# EAGLE schematic Actuator (EAGLE 9.5.1)

## Sheet 1 of 3: Connectors
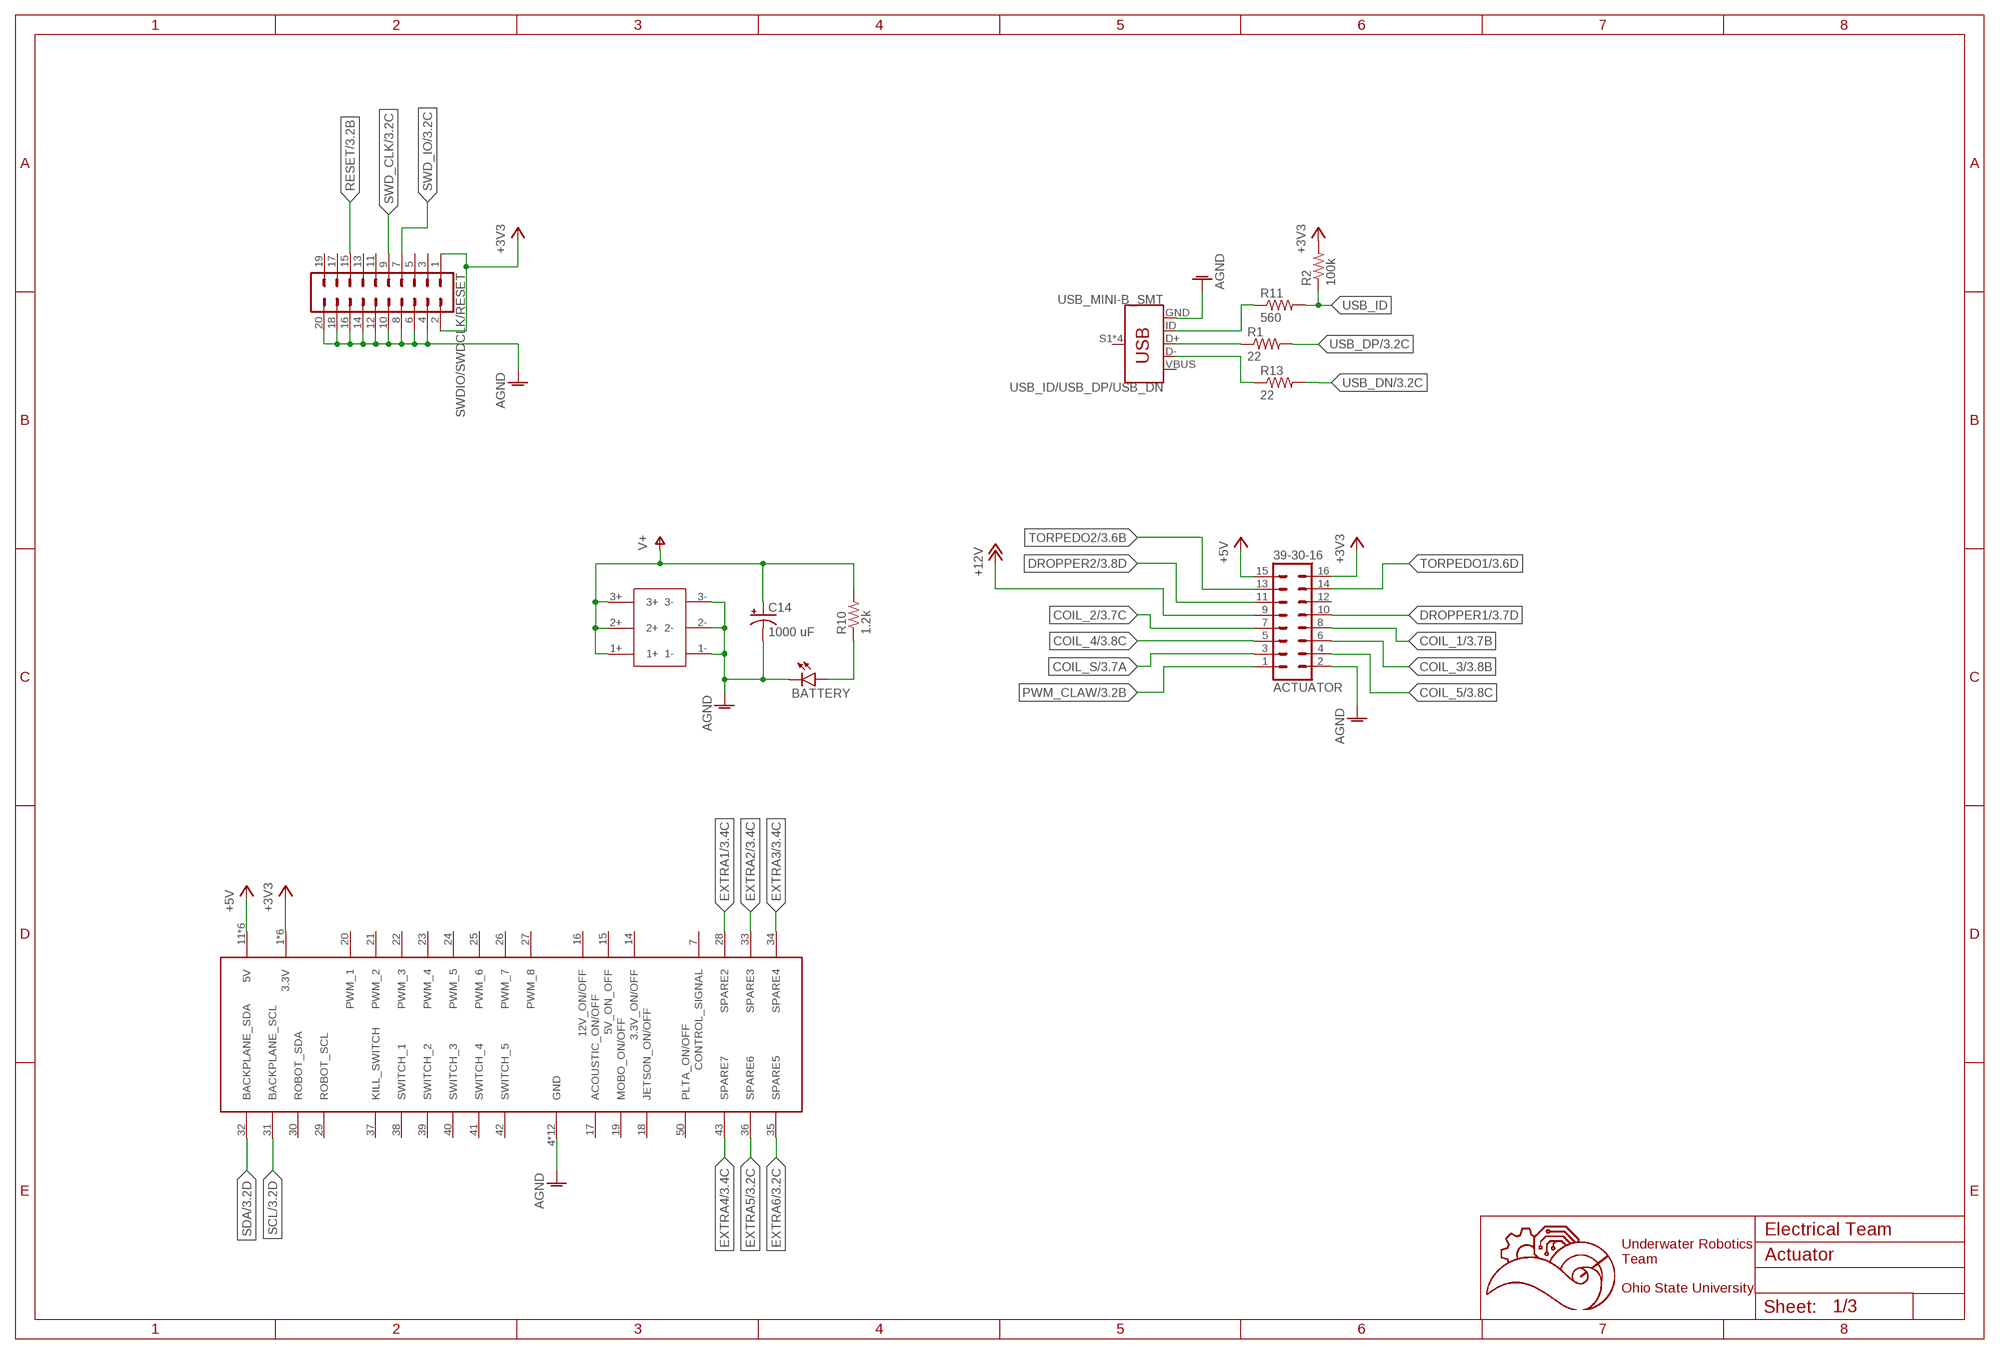
[diagram p0: schematic, sheet 1]

### Parts
ACTUATOR  39-30-16  [39-30-?16?]
BATTERY  LEDCHIPLED_0603  [CHIPLED_0603]
C14  1000 uF  CPOL-USE5-13  [E5-13]
R1  22  R-US_R0603  [R0603]
R2  100k  R-US_R0603  [R0603]
R10  1.2k  R-US_R0805  [R0805]
R11  560  R-US_R0603  [R0603]
R13  22  R-US_R0603  [R0603]
SWDIO/SWDCLK/RESET  CONN_10X2  [2X10]
U$1  5530843-EDGE  [5530843-6-BOARDFINGERS]
U$3  6PIN-VERT  [6PIN_VERT]
USB_ID/USB_DP/USB_DN  USB_MINI-B_SMT  [USB-MINIB]

### Nets
+3V3: ACTUATOR.16 R2.2 SWDIO/SWDCLK/RESET.1 SWDIO/SWDCLK/RESET.2 U$1.1(3.3V) U$1.2(3.3V) U$1.3(3.3V) U$1.54(3.3V) U$1.55(3.3V) U$1.56(3.3V) ; also sheet 2,3
+5V: ACTUATOR.15 U$1.11(5V) U$1.12(5V) U$1.13(5V) U$1.44(5V) U$1.45(5V) U$1.46(5V)
+12V: ACTUATOR.9 ; also sheet 3
AGND: ACTUATOR.2 BATTERY.C C14.- SWDIO/SWDCLK/RESET.4 SWDIO/SWDCLK/RESET.6 SWDIO/SWDCLK/RESET.8 SWDIO/SWDCLK/RESET.10 SWDIO/SWDCLK/RESET.12 SWDIO/SWDCLK/RESET.14 SWDIO/SWDCLK/RESET.16 SWDIO/SWDCLK/RESET.18 SWDIO/SWDCLK/RESET.20 U$1.4(GND) U$1.5(GND) U$1.6(GND) U$1.8(GND) U$1.9(GND) U$1.10(GND) U$1.47(GND) U$1.48(GND) U$1.49(GND) U$1.51(GND) U$1.52(GND) U$1.53(GND) U$3.1- U$3.2- U$3.3- USB_ID/USB_DP/USB_DN.GND ; also sheet 2,3
COIL_1: ACTUATOR.8 ; also sheet 3
COIL_2: ACTUATOR.7 ; also sheet 3
COIL_3: ACTUATOR.6 ; also sheet 3
COIL_4: ACTUATOR.5 ; also sheet 3
COIL_5: ACTUATOR.4 ; also sheet 3
COIL_S: ACTUATOR.3 ; also sheet 3
DROPPER1: ACTUATOR.10 ; also sheet 3
DROPPER2: ACTUATOR.11 ; also sheet 3
EXTRA1: U$1.28(SPARE2) ; also sheet 3
EXTRA2: U$1.33(SPARE3) ; also sheet 3
EXTRA3: U$1.34(SPARE4) ; also sheet 3
EXTRA4: U$1.43(SPARE7) ; also sheet 3
EXTRA5: U$1.36(SPARE6) ; also sheet 3
EXTRA6: U$1.35(SPARE5) ; also sheet 3
N$6: R11.1 USB_ID/USB_DP/USB_DN.ID
N$7: R1.1 USB_ID/USB_DP/USB_DN.D+
N$8: R13.1 USB_ID/USB_DP/USB_DN.D-
N$9: BATTERY.A R10.1
PWM_CLAW: ACTUATOR.1 ; also sheet 3
RESET: SWDIO/SWDCLK/RESET.15 ; also sheet 3
SCL: U$1.31(BACKPLANE_SCL) ; also sheet 3
SDA: U$1.32(BACKPLANE_SDA) ; also sheet 3
SWD_CLK: SWDIO/SWDCLK/RESET.9 ; also sheet 3
SWD_IO: SWDIO/SWDCLK/RESET.7 ; also sheet 3
TORPEDO1: ACTUATOR.14 ; also sheet 3
TORPEDO2: ACTUATOR.13 ; also sheet 3
USB_DN: R13.2 ; also sheet 3
USB_DP: R1.2 ; also sheet 3
USB_ID: R2.1 R11.2
V+: C14.+ R10.2 U$3.1+ U$3.2+ U$3.3+ ; also sheet 2
Unconnected: ACTUATOR.12 SWDIO/SWDCLK/RESET.3 SWDIO/SWDCLK/RESET.5 SWDIO/SWDCLK/RESET.11 SWDIO/SWDCLK/RESET.13 SWDIO/SWDCLK/RESET.17 SWDIO/SWDCLK/RESET.19 U$1.7(CONTROL_SIGNAL) U$1.14(3.3V_ON/OFF) U$1.15(5V_ON_OFF) U$1.16(12V_ON/OFF) U$1.17(ACOUSTIC_ON/OFF) U$1.18(JETSON_ON/OFF) U$1.19(MOBO_ON/OFF) U$1.20(PWM_1) U$1.21(PWM_2) U$1.22(PWM_3) U$1.23(PWM_4) U$1.24(PWM_5) U$1.25(PWM_6) U$1.26(PWM_7) U$1.27(PWM_8) U$1.29(ROBOT_SCL) U$1.30(ROBOT_SDA) U$1.37(KILL_SWITCH) U$1.38(SWITCH_1) U$1.39(SWITCH_2) U$1.40(SWITCH_3) U$1.41(SWITCH_4) U$1.42(SWITCH_5) U$1.50(PLTA_ON/OFF) USB_ID/USB_DP/USB_DN.S1(SHIELD) USB_ID/USB_DP/USB_DN.S2(SHIELD) USB_ID/USB_DP/USB_DN.S3(SHIELD) USB_ID/USB_DP/USB_DN.S4(SHIELD)

### Notes on the sheet
- Electrical Team
- Underwater Robotics
  Team
  
  Ohio State University

## Sheet 2 of 3
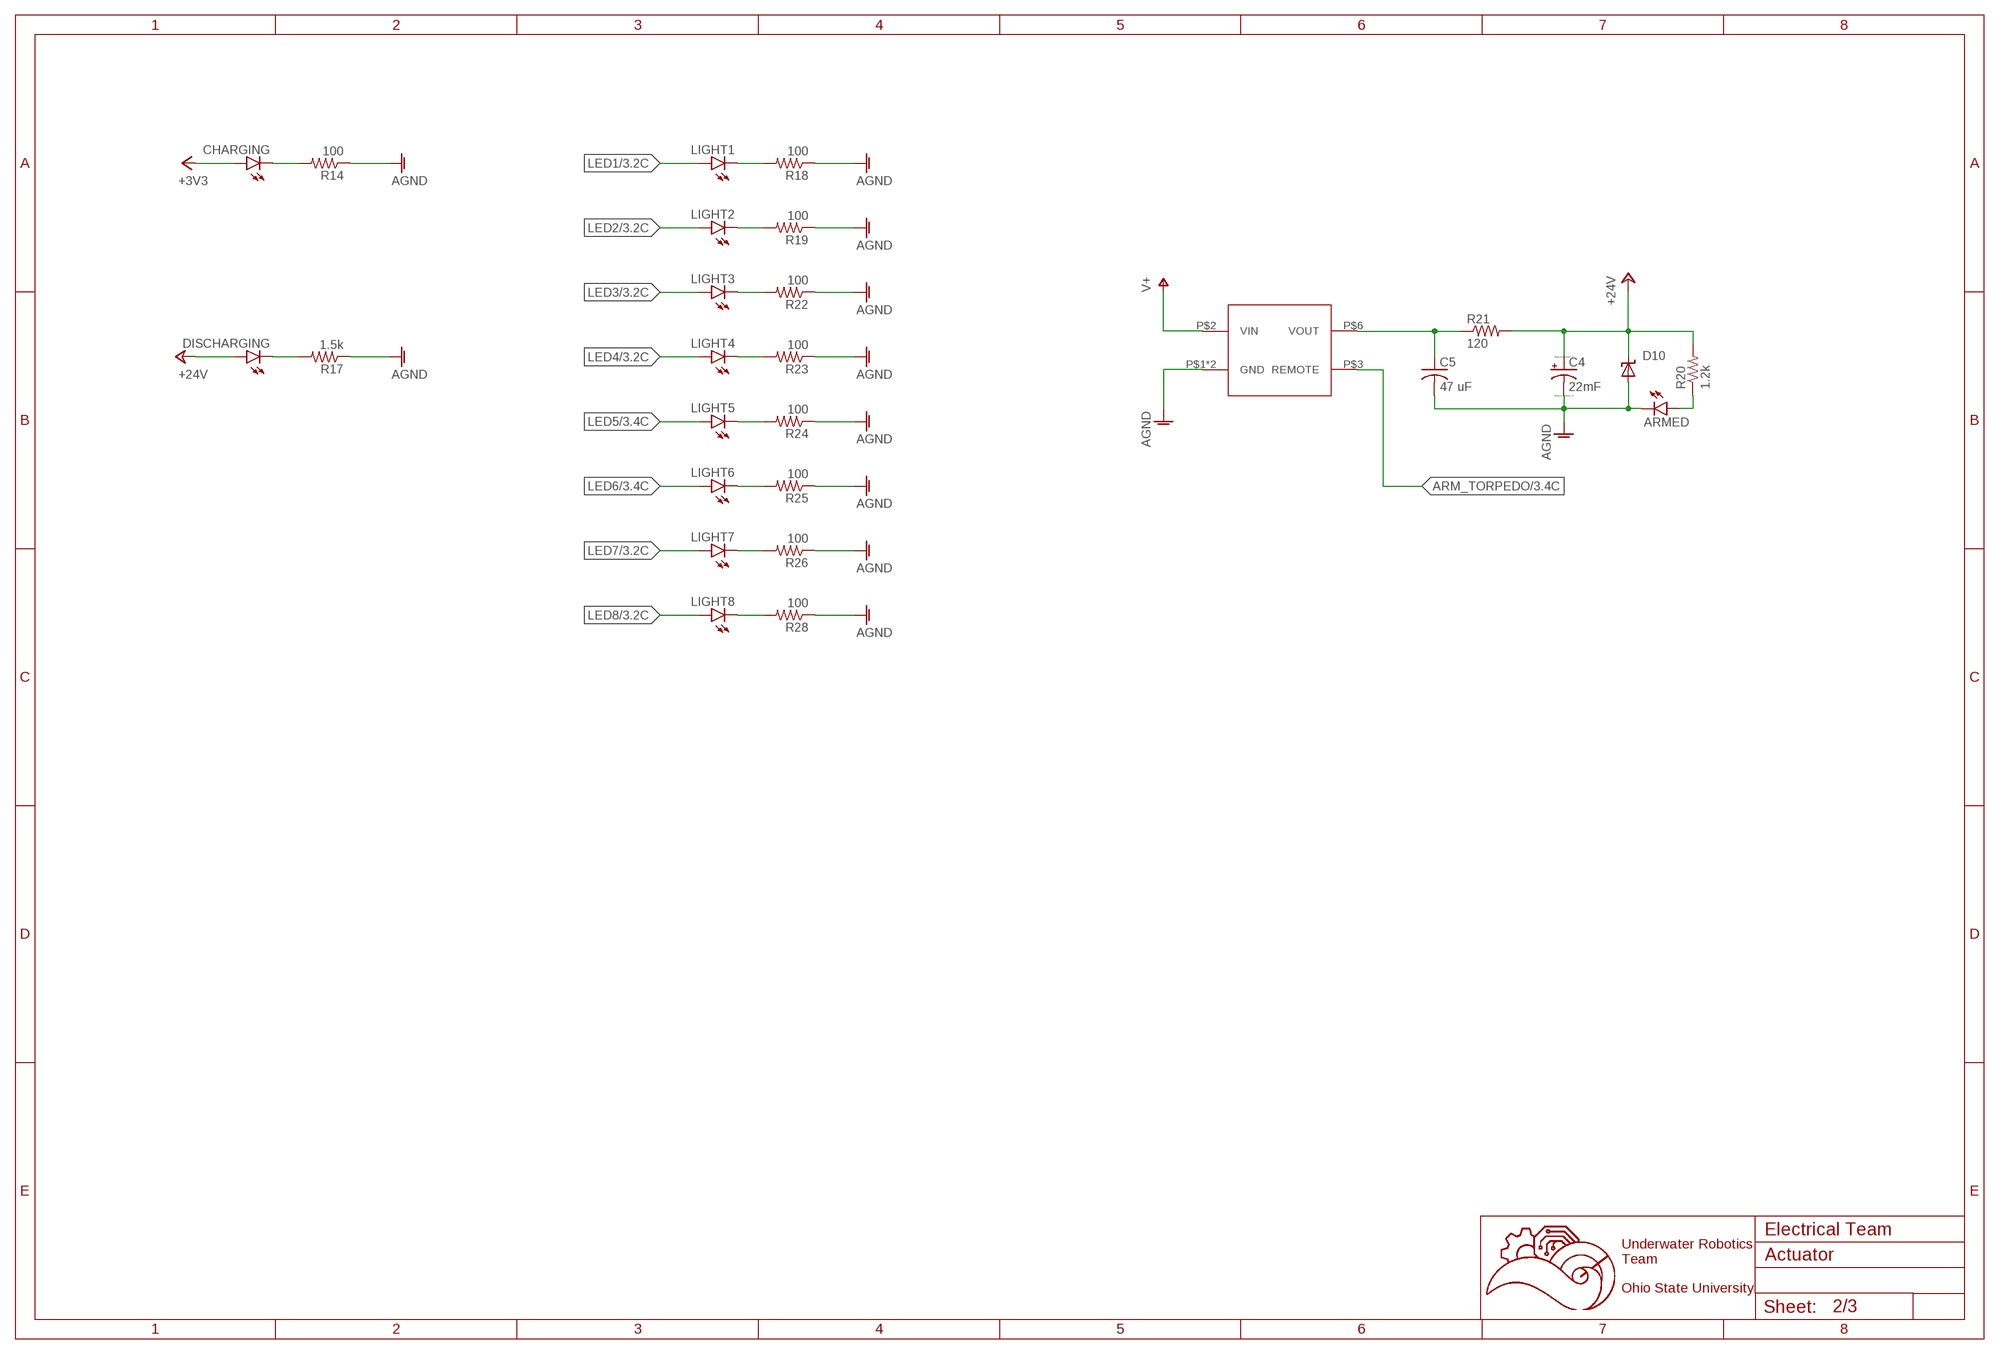
[diagram p1: schematic, sheet 2]

### Parts
ARMED  LEDCHIPLED_0603  [CHIPLED_0603]
C4  22mF  CPOL-USE10-30  [EB30D]
C5  47 uF  C-USC1206K  [C1206K]
CHARGING  LEDCHIPLED_0603  [CHIPLED_0603]
D10  SUPPRESSOR-SMBJ  [SMBJ]
DISCHARGING  LEDCHIPLED_0603  [CHIPLED_0603]
LIGHT1  LEDCHIPLED_0603  [CHIPLED_0603]
LIGHT2  LEDCHIPLED_0603  [CHIPLED_0603]
LIGHT3  LEDCHIPLED_0603  [CHIPLED_0603]
LIGHT4  LEDCHIPLED_0603  [CHIPLED_0603]
LIGHT5  LEDCHIPLED_0603  [CHIPLED_0603]
LIGHT6  LEDCHIPLED_0603  [CHIPLED_0603]
LIGHT7  LEDCHIPLED_0603  [CHIPLED_0603]
LIGHT8  LEDCHIPLED_0603  [CHIPLED_0603]
R14  100  R-US_R0805  [R0805]
R17  1.5k  R-US_R0805  [R0805]
R18  100  R-US_R0805  [R0805]
R19  100  R-US_R0805  [R0805]
R20  1.2k  R-US_R0805  [R0805]
R21  120  R-US_R6332W  [R6332W]
R22  100  R-US_R0805  [R0805]
R23  100  R-US_R0805  [R0805]
R24  100  R-US_R0805  [R0805]
R25  100  R-US_R0805  [R0805]
R26  100  R-US_R0805  [R0805]
R28  100  R-US_R0805  [R0805]
U$6  TMR6-2415  [TMR6-2415]

### Nets
+3V3: CHARGING.A ; also sheet 1,3
+24V: C4.+ D10.C DISCHARGING.A R20.2 R21.2 ; also sheet 3
AGND: ARMED.C C4.- C5.2 D10.A R14.1 R17.1 R18.1 R19.1 R22.1 R23.1 R24.1 R25.1 R26.1 R28.1 U$6.P$1(GND) U$6.P$7(GND) ; also sheet 1,3
ARM_TORPEDO: U$6.P$3(REMOTE) ; also sheet 3
LED1: LIGHT1.A ; also sheet 3
LED2: LIGHT2.A ; also sheet 3
LED3: LIGHT3.A ; also sheet 3
LED4: LIGHT4.A ; also sheet 3
LED5: LIGHT5.A ; also sheet 3
LED6: LIGHT6.A ; also sheet 3
LED7: LIGHT7.A ; also sheet 3
LED8: LIGHT8.A ; also sheet 3
N$4: CHARGING.C R14.2
N$10: ARMED.A R20.1
N$15: DISCHARGING.C R17.2
N$16: LIGHT1.C R18.2
N$17: LIGHT2.C R19.2
N$18: LIGHT3.C R22.2
N$19: LIGHT4.C R23.2
N$21: LIGHT5.C R24.2
N$22: LIGHT6.C R25.2
N$23: LIGHT7.C R26.2
N$24: LIGHT8.C R28.2
N$26: C5.1 R21.1 U$6.P$6(VOUT)
V+: U$6.P$2(VIN) ; also sheet 1

### Notes on the sheet
- Electrical Team
- Underwater Robotics
  Team
  
  Ohio State University

## Sheet 3 of 3
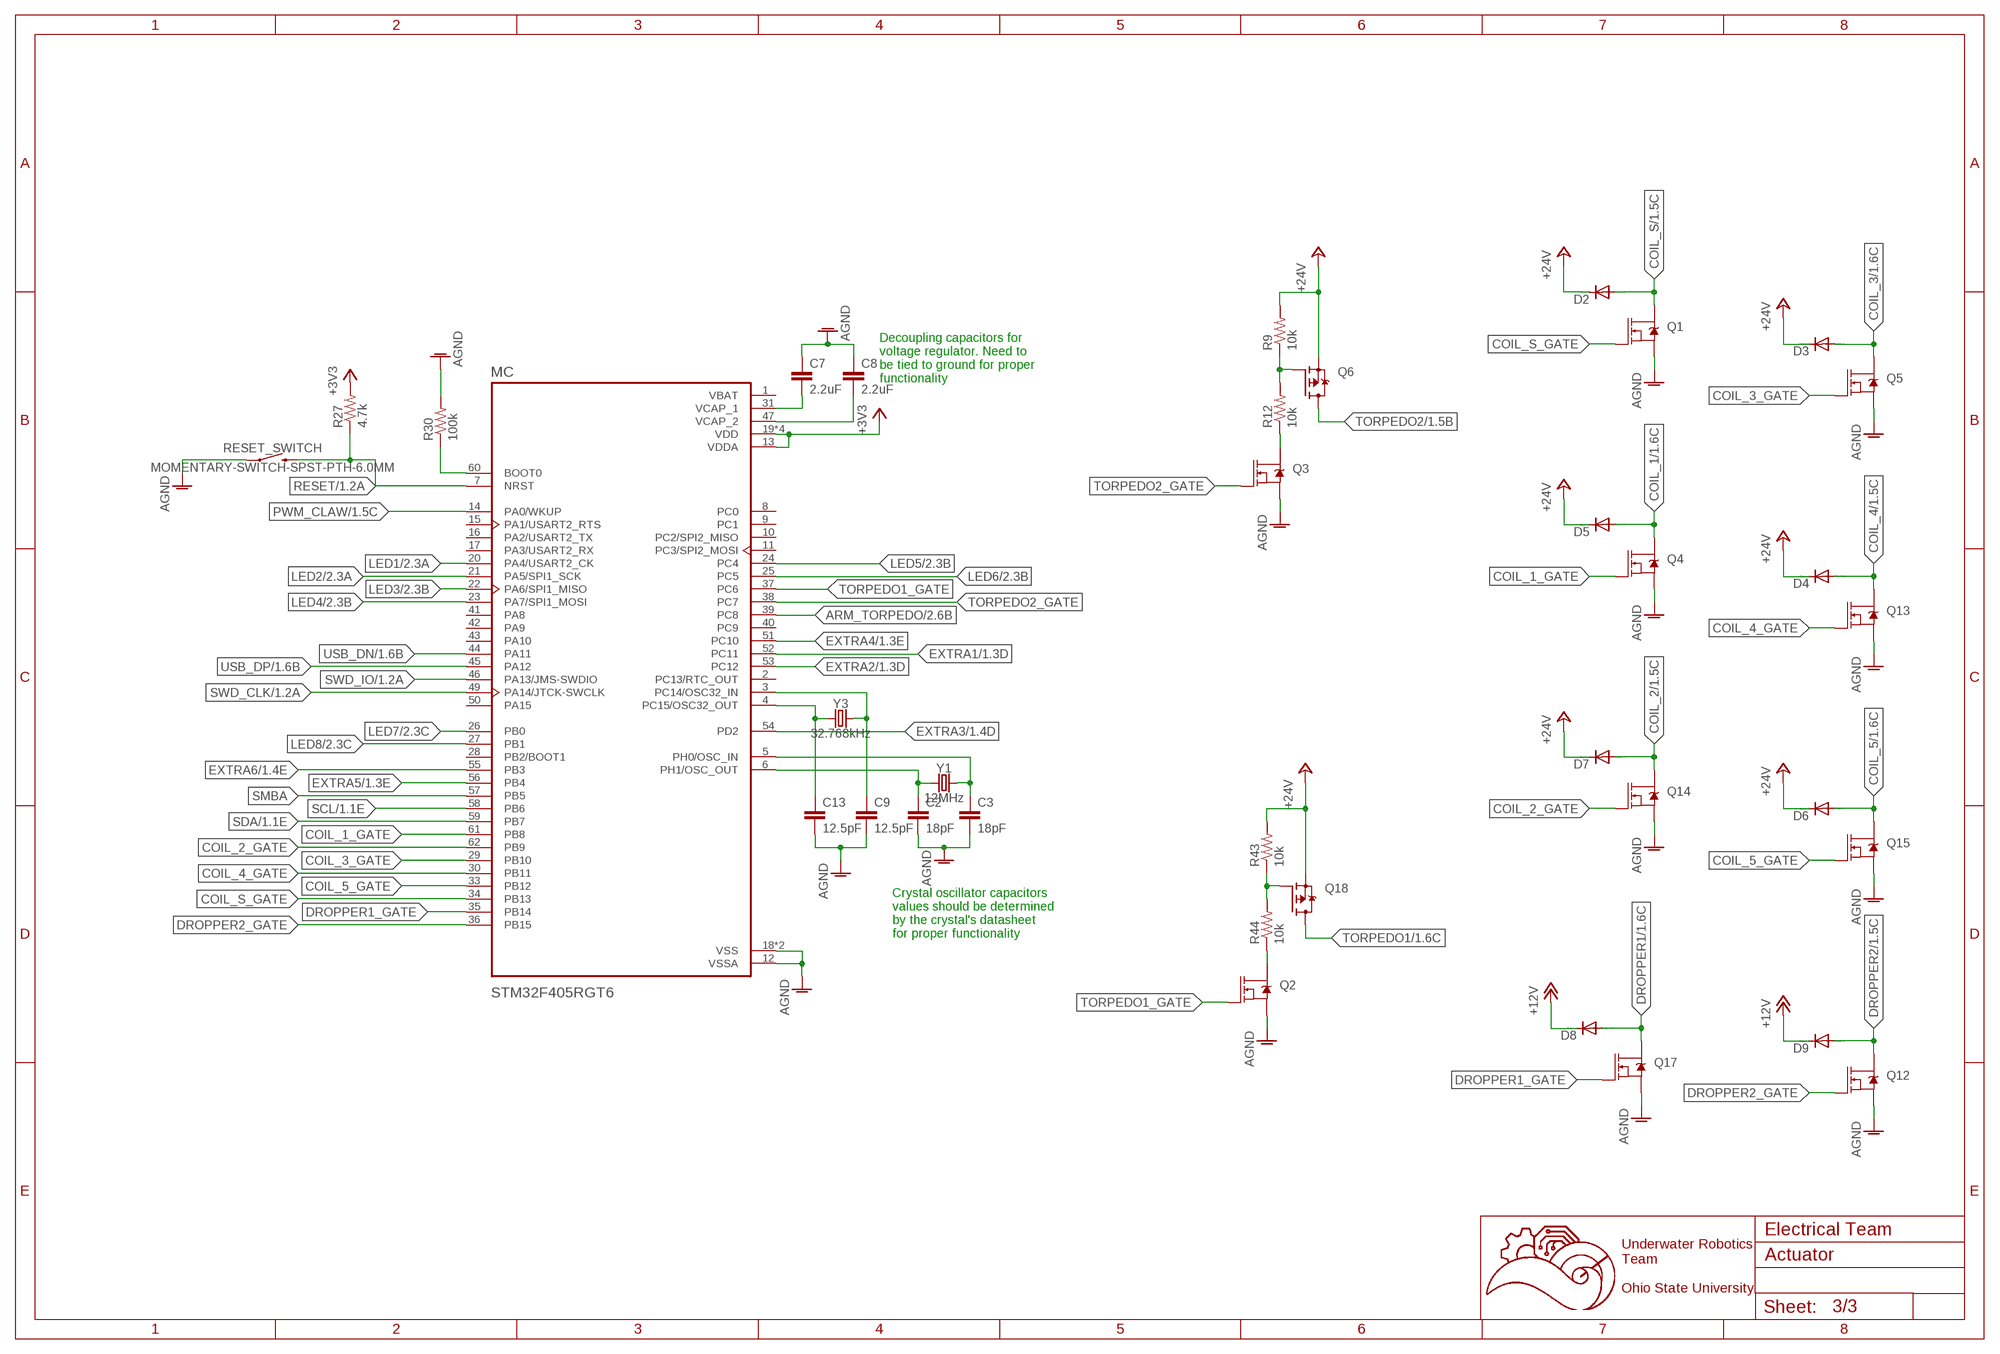
[diagram p2: schematic, sheet 3]

### Parts
C2  18pF  C-EUC0603  [C0603]
C3  18pF  C-EUC0603  [C0603]
C7  2.2uF  C-EUC0603  [C0603]
C8  2.2uF  C-EUC0603  [C0603]
C9  12.5pF  C-EUC0603  [C0603]
C13  12.5pF  C-EUC0603  [C0603]
D2  DIODE-SMB  [SMB]
D3  DIODE-SMB  [SMB]
D4  DIODE-SMB  [SMB]
D5  DIODE-SMB  [SMB]
D6  DIODE-SMB  [SMB]
D7  DIODE-SMB  [SMB]
D8  DIODE-SMB  [SMB]
D9  DIODE-SMB  [SMB]
MC  STM32F405RGT6  [QFP50P1200X1200X160-64N]
Q1  MOSFET-NCH-AO3404A  [SOT23-3]
Q2  MOSFET-NCH-AO3404A  [SOT23-3]
Q3  MOSFET-NCH-AO3404A  [SOT23-3]
Q4  MOSFET-NCH-AO3404A  [SOT23-3]
Q5  MOSFET-NCH-AO3404A  [SOT23-3]
Q6  FDD4141TO252  [TO252]
Q12  MOSFET-NCH-AO3404A  [SOT23-3]
Q13  MOSFET-NCH-AO3404A  [SOT23-3]
Q14  MOSFET-NCH-AO3404A  [SOT23-3]
Q15  MOSFET-NCH-AO3404A  [SOT23-3]
Q17  MOSFET-NCH-AO3404A  [SOT23-3]
Q18  FDD4141TO252  [TO252]
R9  10k  R-US_R0603  [R0603]
R12  10k  R-US_R0603  [R0603]
R27  4.7k  R-US_R0603  [R0603]
R30  100k  R-US_R0603  [R0603]
R43  10k  R-US_R0603  [R0603]
R44  10k  R-US_R0603  [R0603]
RESET_SWITCH  MOMENTARY-SWITCH-SPST-PTH-6.0MM  [TACTILE_SWITCH_PTH_6.0MM]
Y1  12MHz  CRYSTAL-16MHZPTH-HC49US  [HC49US]
Y3  32.768kHz  CRYSTAL-32.768KHZSMD-3.2X1.5  [CRYSTAL-SMD-3.2X1.5MM]

### Nets
+3V3: MC.13(VDDA) MC.19(VDD) MC.32(VDD) MC.48(VDD) MC.64(VDD) R27.2 ; also sheet 1,2
+12V: D8.C D9.C ; also sheet 1
+24V: D2.C D3.C D4.C D5.C D6.C D7.C Q6.2(S) Q18.2(S) R9.2 R43.2 ; also sheet 2
AGND: C2.2 C3.2 C7.1 C8.1 C9.2 C13.2 MC.12(VSSA) MC.18(VSS) MC.63(VSS) Q1.2(S) Q2.2(S) Q3.2(S) Q4.2(S) Q5.2(S) Q12.2(S) Q13.2(S) Q14.2(S) Q15.2(S) Q17.2(S) R30.2 RESET_SWITCH.1 ; also sheet 1,2
ARM_TORPEDO: MC.39(PC8) ; also sheet 2
COIL_1: D5.A Q4.3(D) ; also sheet 1
COIL_1_GATE: MC.61(PB8) Q4.1(G)
COIL_2: D7.A Q14.3(D) ; also sheet 1
COIL_2_GATE: MC.62(PB9) Q14.1(G)
COIL_3: D3.A Q5.3(D) ; also sheet 1
COIL_3_GATE: MC.29(PB10) Q5.1(G)
COIL_4: D4.A Q13.3(D) ; also sheet 1
COIL_4_GATE: MC.30(PB11) Q13.1(G)
COIL_5: D6.A Q15.3(D) ; also sheet 1
COIL_5_GATE: MC.33(PB12) Q15.1(G)
COIL_S: D2.A Q1.3(D) ; also sheet 1
COIL_S_GATE: MC.34(PB13) Q1.1(G)
DROPPER1: D8.A Q17.3(D) ; also sheet 1
DROPPER1_GATE: MC.35(PB14) Q17.1(G)
DROPPER2: D9.A Q12.3(D) ; also sheet 1
DROPPER2_GATE: MC.36(PB15) Q12.1(G)
EXTRA1: MC.52(PC11) ; also sheet 1
EXTRA2: MC.53(PC12) ; also sheet 1
EXTRA3: MC.54(PD2) ; also sheet 1
EXTRA4: MC.51(PC10) ; also sheet 1
EXTRA5: MC.56(PB4) ; also sheet 1
EXTRA6: MC.55(PB3) ; also sheet 1
LED1: MC.20(PA4/USART2_CK) ; also sheet 2
LED2: MC.21(PA5/SPI1_SCK) ; also sheet 2
LED3: MC.22(PA6/SPI1_MISO) ; also sheet 2
LED4: MC.23(PA7/SPI1_MOSI) ; also sheet 2
LED5: MC.24(PC4) ; also sheet 2
LED6: MC.25(PC5) ; also sheet 2
LED7: MC.26(PB0) ; also sheet 2
LED8: MC.27(PB1) ; also sheet 2
N$1: C2.1 MC.6(PH1/OSC_OUT) Y1.1
N$2: C3.1 MC.5(PH0/OSC_IN) Y1.2
N$3: C8.2 MC.47(VCAP_2)
N$5: C13.1 MC.4(PC15/OSC32_OUT) Y3.P$1
N$11: C7.2 MC.31(VCAP_1)
N$14: Q2.3(D) R44.1
N$20: Q18.1(G) R43.1 R44.2
N$25: Q6.1(G) R9.1 R12.2
N$28: Q3.3(D) R12.1
N$29: C9.1 MC.3(PC14/OSC32_IN) Y3.P$2
N$30: MC.60(BOOT0) R30.1
PWM_CLAW: MC.14(PA0/WKUP) ; also sheet 1
RESET: MC.7(NRST) R27.1 RESET_SWITCH.3 ; also sheet 1
SCL: MC.58(PB6) ; also sheet 1
SDA: MC.59(PB7) ; also sheet 1
SMBA: MC.57(PB5)
SWD_CLK: MC.49(PA14/JTCK-SWCLK) ; also sheet 1
SWD_IO: MC.46(PA13/JMS-SWDIO) ; also sheet 1
TORPEDO1: Q18.3(D) ; also sheet 1
TORPEDO1_GATE: MC.37(PC6) Q2.1(G)
TORPEDO2: Q6.3(D) ; also sheet 1
TORPEDO2_GATE: MC.38(PC7) Q3.1(G)
USB_DN: MC.44(PA11) ; also sheet 1
USB_DP: MC.45(PA12) ; also sheet 1
Unconnected: MC.2(PC13/RTC_OUT) MC.8(PC0) MC.9(PC1) MC.10(PC2/SPI2_MISO) MC.11(PC3/SPI2_MOSI) MC.15(PA1/USART2_RTS) MC.16(PA2/USART2_TX) MC.17(PA3/USART2_RX) MC.28(PB2/BOOT1) MC.40(PC9) MC.41(PA8) MC.42(PA9) MC.43(PA10) MC.50(PA15)

### Notes on the sheet
- Decoupling capacitors for 
  voltage regulator. Need to
  be tied to ground for proper
  functionality
- Crystal oscillator capacitors
  values should be determined
  by the crystal's datasheet
  for proper functionality
- Electrical Team
- Underwater Robotics
  Team
  
  Ohio State University

## Power pins joined to a net without a drawn wire
VBAT: MC.1(VBAT)
VBUS: USB_ID/USB_DP/USB_DN.VBUS

## Library data of the parts
ACTUATOR = con-molex-mini-fit:39-30-?16?: HEADER
ARMED BATTERY CHARGING DISCHARGING LIGHT1-LIGHT8 = led:LED: LED OSRAM: - CHIPLED LG R971, LG N971, LY N971, LG Q971, LY Q971, LO R971, LY R971 LH N974, LH R974 LS Q976, LO Q976, LY Q976 LO Q996 - Hyper CHIPLED LW Q18S LB Q993, LB Q99A, LB R99A - SideLED LS A670, LO A670, LY A670, LG A670, LP A670 LB A673, LV A673, LT A673, LW A673 LH A674 LY A675 LS A676, LA A676, LO A676, LY A676, LW A676 LS A679, LY A679, LG A679 - Hyper Micro SIDELED® LS Y876, LA Y876, LO Y876, LY Y876 LT Y87S - SmartLED LW L88C, LW L88S LB L89C, LB L89S, LG L890 LS L89K, LO L89K, LY L89K LS L896, LA L896, LO L896, LY L896 - TOPLED LS T670, LO T670, LY T670, LG T670, LP T670 LSG T670, LSP T670, LSY T670, LOP T670, LYG T670 LG T671, LOG T671, LSG T671 LB T673, LV T673, LT T673, LW T673 LH T674 LS T676, LA T676, LO T676, LY T676, LB T676, LH T676, LSB T676, LW T676 LB T67C, LV T67C, LT T67C, LS T67K, LO T67K, LY T67K, LW E67C LS E67B, LA E67B, LO E67B, LY E67B, LB E67C, LV E67C, LT E67C LW T67C LS T679, LY T679, LG T679 LS T770, LO T770, LY T770, LG T770, LP T770 LB T773, LV T773, LT T773, LW T773 LH T774 LS E675, LA E675, LY E675, LS T675 LS T776, LA T776, LO T776, LY T776, LB T776 LHGB T686 LT T68C, LB T68C - Hyper Mini TOPLED® LB M676 - Mini TOPLED Santana® LG M470 LS M47K, LO M47K, LY M47K Source: http://www.osram.convergy.de LUXEON: - LUMILED® LXK2-PW12-R00, LXK2-PW12-S00, LXK2-PW14-U00, LXK2-PW14-V00 LXK2-PM12-R00, LXK2-PM12-S00, LXK2-PM14-U00 LXK2-PE12-Q00, LXK2-PE12-R00, LXK2-PE12-S00, LXK2-PE14-T00, LXK2-PE14-U00 LXK2-PB12-K00, LXK2-PB12-L00, LXK2-PB12-M00, LXK2-PB14-N00, LXK2-PB14-P00, LXK2-PB14-Q00 LXK2-PR12-L00, LXK2-PR12-M00, LXK2-PR14-Q00, LXK2-PR14-R00 LXK2-PD12-Q00, LXK2-PD12-R00, LXK2-PD12-S00 LXK2-PH12-R00, LXK2-PH12-S00 LXK2-PL12-P00, LXK2-PL12-Q00, LXK2-PL12-R00 Source: www.luxeon.com KINGBRIGHT: KA-3528ASYC Source: www.kingbright.com
C2 C3 C7-C9 C13 = rcl:C-EU: CAPACITOR, European symbol; SPICEPREFIX: C
C4 = resistor:CPOL-US: POLARIZED CAPACITOR, American symbol
C5 = resistor:C-US: CAPACITOR, American symbol
C14 = rcl:CPOL-US: POLARIZED CAPACITOR, American symbol; SPICEPREFIX: C
D2-D9 = diode:DIODE-: DIODE
D10 = diode:SUPPRESSOR-: Suppressor diode
MC = STM32F405RGT6:STM32F405RGT6: High-performance foundation line, ARM Cortex-M4 core with DSP and FPU, 1 Mbyte Flash, 168 MHz CPU, ART Accelerator; AVAILABILITY: Unavailable; DESCRIPTION: High-performance foundation line, ARM Cortex-M4 core with DSP and FPU, 1 Mbyte Flash, 168 MHz CPU, ART Accelerator; MF: STMicroelectronics; MP: STM32F405RGT6; PACKAGE: LQFP-64 STMicroelectronics; PRICE: None
Q1-Q5 Q12-Q15 Q17 = SparkFun-DiscreteSemi:MOSFET-NCH: N-channel MOSFETs Voltage controlled devices that allow control of high current outputs. SparkFun Products: SparkFun OpenScale <https://www.sparkfun.com/products/13261> SparkFun Digital Sandbox <https://www.sparkfun.com/products/12651> SparkFun Monster Moto Shield <https://www.sparkfun.com/products/10182> SparkFun MOSFET Power Controller <https://www.sparkfun.com/products/11214>; PROD_ID: TRANS-12988; VALUE: 5.8A/30V/35mΩ
Q6 Q18 = transistor-fet:FDD4141: P-Channel PowerTrench® MOSFET Source: FDD4141.pdf
R1 R2 R11 R13 R27 R30 = rcl:R-US_: RESISTOR, American symbol; SPICEPREFIX: R
R9 R10 R12 R14 R17-R26 R28 R43 R44 = resistor:R-US_: RESISTOR, American symbol
RESET_SWITCH = SparkFun-Switches:MOMENTARY-SWITCH-SPST: Momentary Switch (Pushbutton) - SPST Normally-open (NO) SPST momentary switches (buttons, pushbuttons). Variants PTH-12MM - 12mm square, through-hole Momentary Pushbutton Switch - 12mm Square <https://www.sparkfun.com/products/9190> (COM-09190) PTH-6.0MM, PTH-6.0MM-KIT - 6.0mm square, through-hole Mini Pushbutton Switch <https://www.sparkfun.com/products/97> (COM-00097) KIT package intended for soldering kit's - only one side of pads' copper is exposed. PTH-RIGHT-ANGLE-KIT - Right-angle, through-hole Right Angle Tactile Button <https://www.sparkfun.com/products/10791> - Used on SparkFun BigTime Watch Kit <https://www.sparkfun.com/products/11734> SMD-12MM - 12mm square, surface-mount Tactile Button - SMD (12mm) <https://www.sparkfun.com/products/12993> (COM-12993) Used on SparkFun PicoBoard <https://www.sparkfun.com/products/11888> SMD-4.5MM - 4.5mm Square Trackball Switch Used on SparkFun Blackberry Trackballer Breakout <https://www.sparkfun.com/products/13169> SMD-4.6MMX2.8MM - 4.60mm x 2.80mm, surface mount Used on SparkFun SAMD21 Mini Breakout <https://www.sparkfun.com/products/13664> SMD-5.2MM, SMD-5.2-REDUNDANT - 5.2mm square, surface-mount Mini Pushbutton Switch - SMD <https://www.sparkfun.com/products/8720> (COM-08720) Used on Arduino Pro Mini <https://www.sparkfun.com/products/11114> REDUNDANT package connects both switch circuits together SMD-6.0X3.5MM - 6.0 x 3.5mm, surface mount Momentary Reset Switch SMD <https://www.sparkfun.com/products/8229> (COM-08229) SMD-6.2MM-TALL - 6.2mm square, surface mount Tactile Button - SMD (6mm) <https://www.sparkfun.com/products/12992> Used on SparkFun Digital Sandbox <https://www.sparkfun.com/products/12651> SMD-RIGHT-ANGLE - Right-angle, surface mount Used on SparkFun Block for Intel® Edison - Arduino <https://www.sparkfun.com/products/13036>; PROD_ID: SWCH-08441; SF_SKU: COM-00097
SWDIO/SWDCLK/RESET = SparkFun-Connectors:CONN_10X2: Multi connection point. Often used as Generic Header-pin footprint for 0.1 inch spaced/style header connections On any of the 0.1 inch spaced packages, you can populate with these: Break Away Headers - Straight <https://www.sparkfun.com/products/116> (PRT-00116) Break Away Male Headers - Right Angle <https://www.sparkfun.com/products/553> (PRT-00553) Female Headers <https://www.sparkfun.com/products/115> (PRT-00115) Break Away Headers - Machine Pin <https://www.sparkfun.com/products/117> (PRT-00117) Break Away Female Headers - Swiss Machine Pin <https://www.sparkfun.com/products/743> (PRT-00743) Special note about the "SPECIAL" package: This was SPECIALLY designed to be used with our Graphic LCD Backpack. Be sure you want to use this! It is not only staggered on each line of header holes, but IT IS ALSO offset of the center point of the top and bottom lines by 5 mil. This causes the headers to lock into place on the "standard" footprint on the LCD screen. The extra squares on the tdocu layer are there simply to reference other pins (if you were to actually populate a longer header than ten long - this is what we do with the backpacks).
U$1 = 5530843-6:5530843-EDGE
U$3 = Vertical_Connectors:6PIN-VERT
U$6 = converter:TMR6-2415
USB_ID/USB_DP/USB_DN = SparkFun-Connectors:USB_MINI-B: USB type Mini-B Connector Breaks out 5th pin, and includes shield pins if needed. SparkFun Products: SparkFun FTDI Basic Breakout <https://www.sparkfun.com/products/9716> SparkFun XBee Explorer USB <https://www.sparkfun.com/products/11812> SparkFun Redboard <https://www.sparkfun.com/products/12757>; PROD_ID: CONN-08193; SF_ID: PRT-00587
Y1 = SparkFun-Clocks:CRYSTAL-16MHZ: 16MHz Crystal Digikey Example <http://www.digikey.com/product-search/en?keywords=535-9122-1-ND> Frequency: 16MHz Frequency Stability: ±50ppm Frequency Tolerance: ±20ppm Load Capacitance: 18pF SparkFun Products: Pro Micro -5V/16MHz <https://www.sparkfun.com/products/12640> SparkFun Serial Enabled LCD Kit <https://www.sparkfun.com/products/10097>; PROD_ID: XTAL-08181; SF_ID: COM-00536; VALUE: 16MHz
Y3 = SparkFun-Clocks:CRYSTAL-32.768KHZ: 32.768kHz Crystal Frequency: 32.768kHz Frequency Stability: ±20ppm Load Capacitance: 12.5pF (PTH-2X6 & SMD-3.2X1.5), 6pF (SMD-2X6) SparkFun Products: SparkFun BigTime Watch Kit <https://www.sparkfun.com/products/11734> SparkFun nRF52832 Breakout <https://www.sparkfun.com/products/13990> SparkFun Real Time Clock Module <https://www.sparkfun.com/products/12708>; PROD_ID: XTAL-13062